# EAGLE design smart_water_heater_v1 (EAGLE 9.6.2)
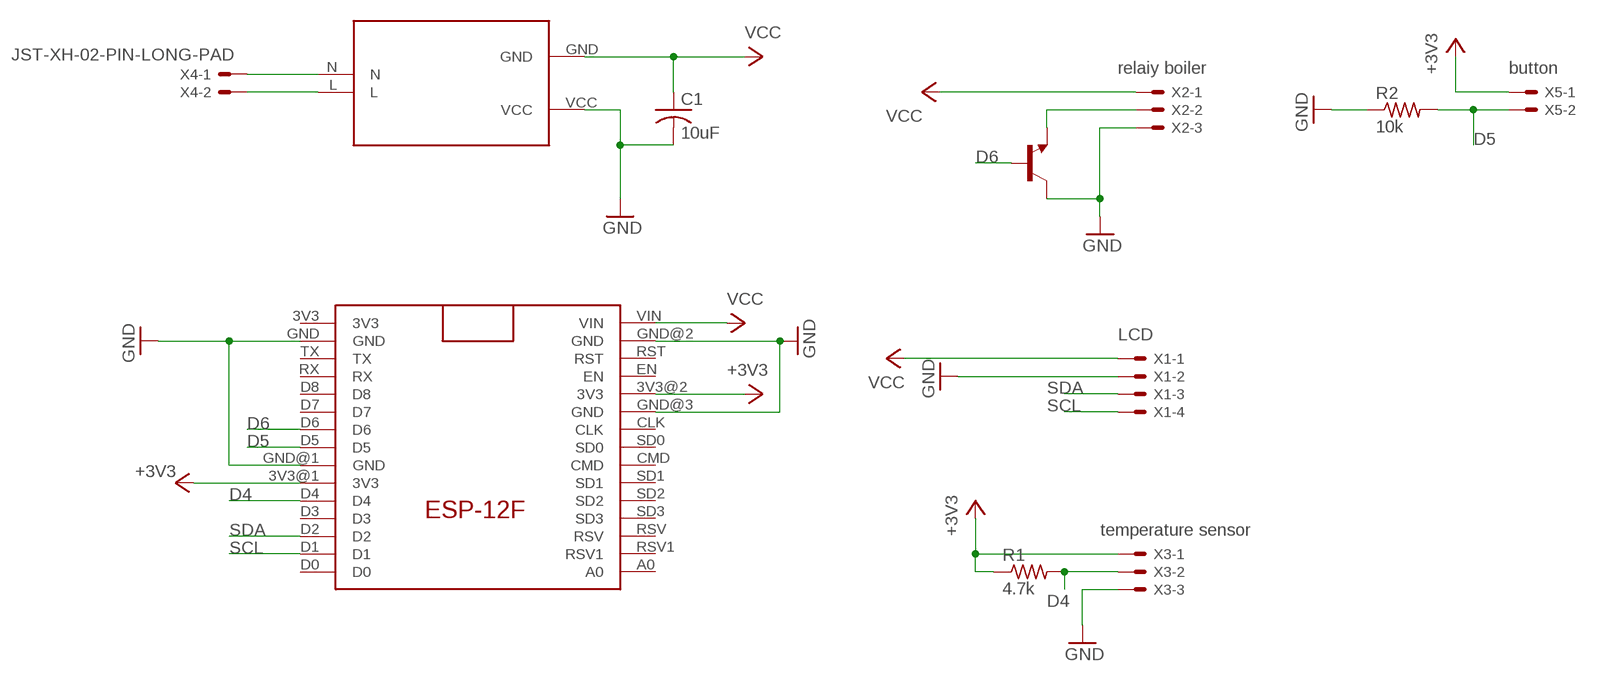
[diagram p0: schematic, sheet 1]

## Parts
C1  10uF  C-US025-025X050  [C025-025X050]
R1  4.7k  R-US_0204/7  [0204/7]
R2  10k  R-US_0204/7  [0204/7]
T1  2N2222  [TO92-EBC-OVAL]
U$1  ESP-12F  [ESP-12F]
U$2  HLK-5M05  [CONV_HLK-5M05]
X1  22-23-2041  [22-23-2041]
X2  22-23-2031  [22-23-2031]
X3  22-23-2031  [22-23-2031]
X4  JST-XH-02-PIN-LONG-PAD  [JST-XH-02-PACKAGE-LONG-PAD]
X5  22-23-2021  [22-23-2021]

## Nets
+3V3: R1.1 U$1.3V3@1(3V3) U$1.3V3@2(3V3) X3.1 X5.1
D4: R1.2 U$1.D4 X3.2
D5: R2.2 U$1.D5 X5.2
D6: T1.B U$1.D6
GND: C1.2 R2.1 T1.C U$1.GND U$1.GND@1(GND) U$1.GND@2(GND) U$1.GND@3(GND) U$2.VCC X1.2 X2.3 X3.3
N$1: U$2.N X4.1
N$2: U$2.L X4.2
N$3: T1.E X2.2
SCL: U$1.D1 X1.4
SDA: U$1.D2 X1.3
VCC: C1.1 U$1.VIN U$2.GND X1.1 X2.1
Unconnected: U$1.3V3 U$1.A0 U$1.CLK U$1.CMD U$1.D0 U$1.D3 U$1.D7 U$1.D8 U$1.EN U$1.RST U$1.RSV U$1.RSV1 U$1.RX U$1.SD0 U$1.SD1 U$1.SD2 U$1.SD3 U$1.TX

## Notes on the sheet
- relaiy boiler | button
- LCD
- temperature sensor

## Library data of the parts
C1 = adafruit:C-US: CAPACITOR, American symbol
R1 R2 = rcl:R-US_: RESISTOR, American symbol; SPICEPREFIX: R
T1 = adafruit:2N2222: NPN TRANSISTOR Big oval pads
U$1 = esp8266_esp12E:ESP-12F
U$2 = HLK-PM03:HLK-5M05
X1 = con-molex:22-23-2041: .100" (2.54mm) Center Header - 4 Pin; MF: MOLEX; MPN: 22-23-2041; OC_FARNELL: 1462920; OC_NEWARK: 38C0355
X2 X3 = con-molex:22-23-2031: .100" (2.54mm) Center Header - 3 Pin; MF: MOLEX; MPN: 22-23-2031; OC_FARNELL: 1462950; OC_NEWARK: 30C0862
X4 = jstConnector-2.5:JST-XH-02-PIN: JST XH Connector 2 Pin Wire to board connector. Pitch: 2,54 mm, (0.100") Number of pins: 2 Created by Rembrandt Electronics www.rembrandtelectronics.com
X5 = con-molex:22-23-2021: .100" (2.54mm) Center Header - 2 Pin; MF: MOLEX; MPN: 22-23-2021; OC_FARNELL: 1462926; OC_NEWARK: 25C3832

## Board
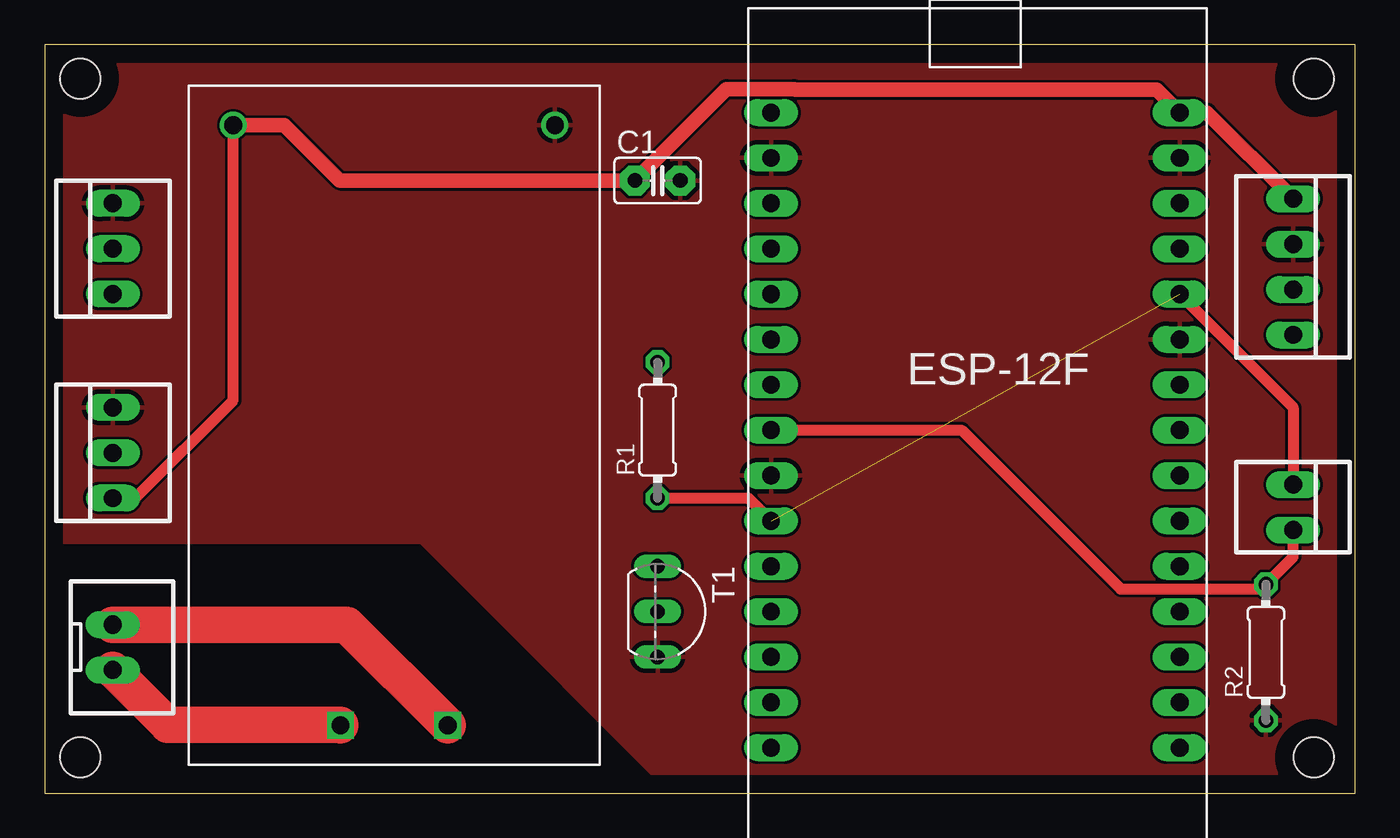
[diagram p1: board, top side]
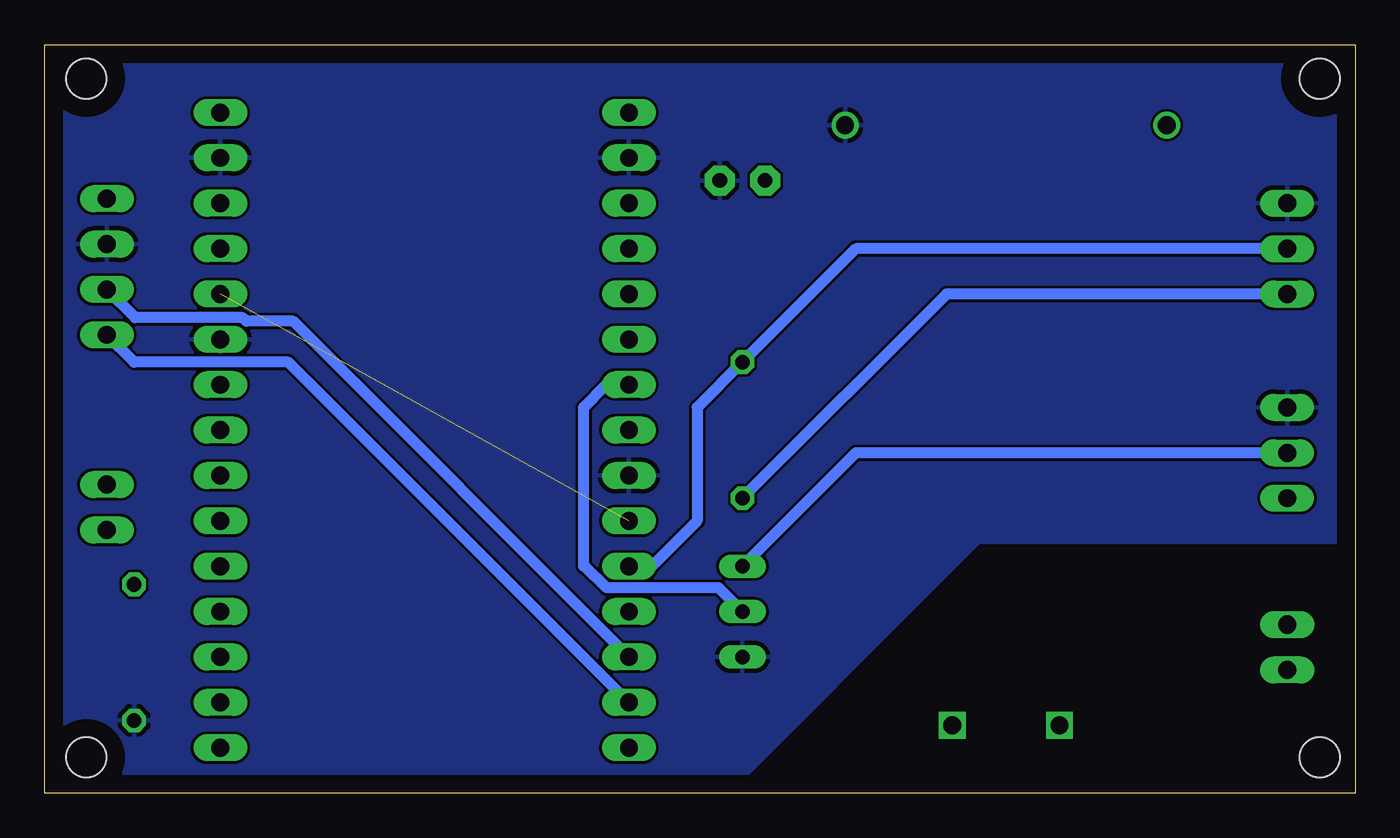
[diagram p2: board, bottom side, seen from below]

Size 73.33 x 41.9 mm. Coordinates in mm from the lower left corner, seen from the top.
Outline: 0,0 73.33,0 73.33,41.9 0,41.9 0,0
Copper layers (1*16): Top 0.035mm / dielectric 1.5mm / Bottom 0.035mm
Design rules "default": minimum track width 6mil, minimum drill 0.35mm, track to track 6mil, track to pad 6mil, pad to pad 6mil, via to via 6mil, smd to smd 6mil, copper to edge 40mil, drill to drill 6mil, minimum pad ring 10mil, minimum via ring 8mil, stop-mask expansion 4mil, vias tented up to drill 0mil, thermal gap 10mil
Holes 2.25 mm at 2,40 71,40 71,2 2,2

### Footprints (pad centres in the part's own frame; a part is rotated, then mirrored left to right if it is on the bottom)
C025-025X050 = drill 0.813 pad 1.676 octagon: 1 -1.27,0; 2 1.27,0
0204/7 = drill 0.813 octagon: 1 -3.81,0; 2 3.81,0
TO92-EBC-OVAL = drill 0.813 long: B 0,-1.27; C 2.54,-1.27; E -2.54,-1.27
ESP-12F = drill 1 long: 3V3 1.27,41.91; 3V3@1 1.27,19.05; 3V3@2 24.13,31.75; A0 24.13,6.35; CLK 24.13,26.67; CMD 24.13,21.59; D0 1.27,6.35; D1 1.27,8.89; D2 1.27,11.43; D3 1.27,13.97; D4 1.27,16.51; D5 1.27,24.13; D6 1.27,26.67; D7 1.27,29.21; D8 1.27,31.75; EN 24.13,34.29; GND 1.27,39.37; GND@1 1.27,21.59; GND@2 24.13,39.37; GND@3 24.13,29.21; RST 24.13,36.83; RSV 24.13,11.43; RSV1 24.13,8.89; RX 1.27,34.29; SD0 24.13,24.13; SD1 24.13,19.05; SD2 24.13,16.51; SD3 24.13,13.97; TX 1.27,36.83; VIN 24.13,41.91
CONV_HLK-5M05 = drill 1: GND 15.8,8.5; VCC 15.8,-9.5 | drill 1 square: L -17.8,2.5; N -17.8,-3.5
22-23-2041 = drill 1 long: 1 -3.81,0; 2 -1.27,0; 3 1.27,0; 4 3.81,0
22-23-2031 = drill 1 long: 1 -2.54,0; 2 0,0; 3 2.54,0
JST-XH-02-PACKAGE-LONG-PAD = drill 1.016 long: 1 -1.27,0; 2 1.27,0
22-23-2021 = drill 1 long: 1 -1.27,0; 2 1.27,0

### Placement (x,y rotation side)
C1  34.29,34.29 0 top
R1  34.29,20.32 90 top
R2  68.33,7.87 90 top
T1  35.56,10.16 270 top
U$1  39.37,-3.81 0 top
U$2  19.05,21.59 90 top
X1  69.85,29.46 270 top
X2  3.81,19.05 90 top
X3  3.81,30.48 90 top
X4  3.81,8.16 270 top
X5  69.85,16 270 top

### Tracks (layer width: path | path; a pad name or v marks a point on that pad's centre or on a via)
+3V3  (1 unrouted)
  Top 0.61: R1.1 39.37,16.51 U$1.3V3@1 | U$1.3V3@2 69.85,21.59 X5.1
  Bottom 0.61: X3.1 22.86,27.94 R1.1
D4
  Bottom 0.61: X3.2 27.94,30.48 R1.2 36.83,21.59 36.83,15.24 39.37,12.7 U$1.D4
D5
  Top 0.61: U$1.D5 51.31,20.32 60.2,11.43 68.07,11.43 R2.2 69.85,13.21 X5.2
D6
  Bottom 0.61: T1.B 35.62,11.49 41.9,11.49 43.11,12.7 43.18,12.7 43.18,21.59 41.91,22.86 U$1.D6
GND
  pour Top: -1,14 21,14 37,-2 76,-2 76,45 -2,45 -2,15
  pour Bottom: -1,14 21,14 37,-2 76,-2 76,45 -2,45 -2,15
N$1
  Top 2.032: X4.1 16.91,9.43 U$2.N
N$2
  Top 2.032: X4.2 6.89,3.81 16.53,3.81 U$2.L
N$3
  Bottom 0.61: X2.2 27.94,19.05 T1.E
SCL
  Bottom 0.61: U$1.D1 59.69,24.13 68.33,24.13 X1.4
SDA
  Bottom 0.61: U$1.D2 59.44,26.42 62.05,26.42 62.24,26.61 68.27,26.61 X1.3
VCC
  Top 0.61: X2.1 5.08,16.51 10.55,21.98 U$2.GND
  Top 0.813: X1.1 65.02,38.1 U$1.VIN 62.23,39.37 41.98,39.37 41.94,39.41 38.14,39.41 C1.1 16.51,34.29 13.41,37.39 U$2.GND

### Text on the board
tTest: temp | LCD 8x2 | gnd | vcc | gnd | Boiler slave v1.1 | 3v3 | sda | scl | rele | gnd | HLK-5M05 | button | vcc | AC | 2N3904 | JLCJLCJLCJLC
bTest: Il garage del Bicchio